# Altium project LV_breakout_1 - Copy.PrjPcb
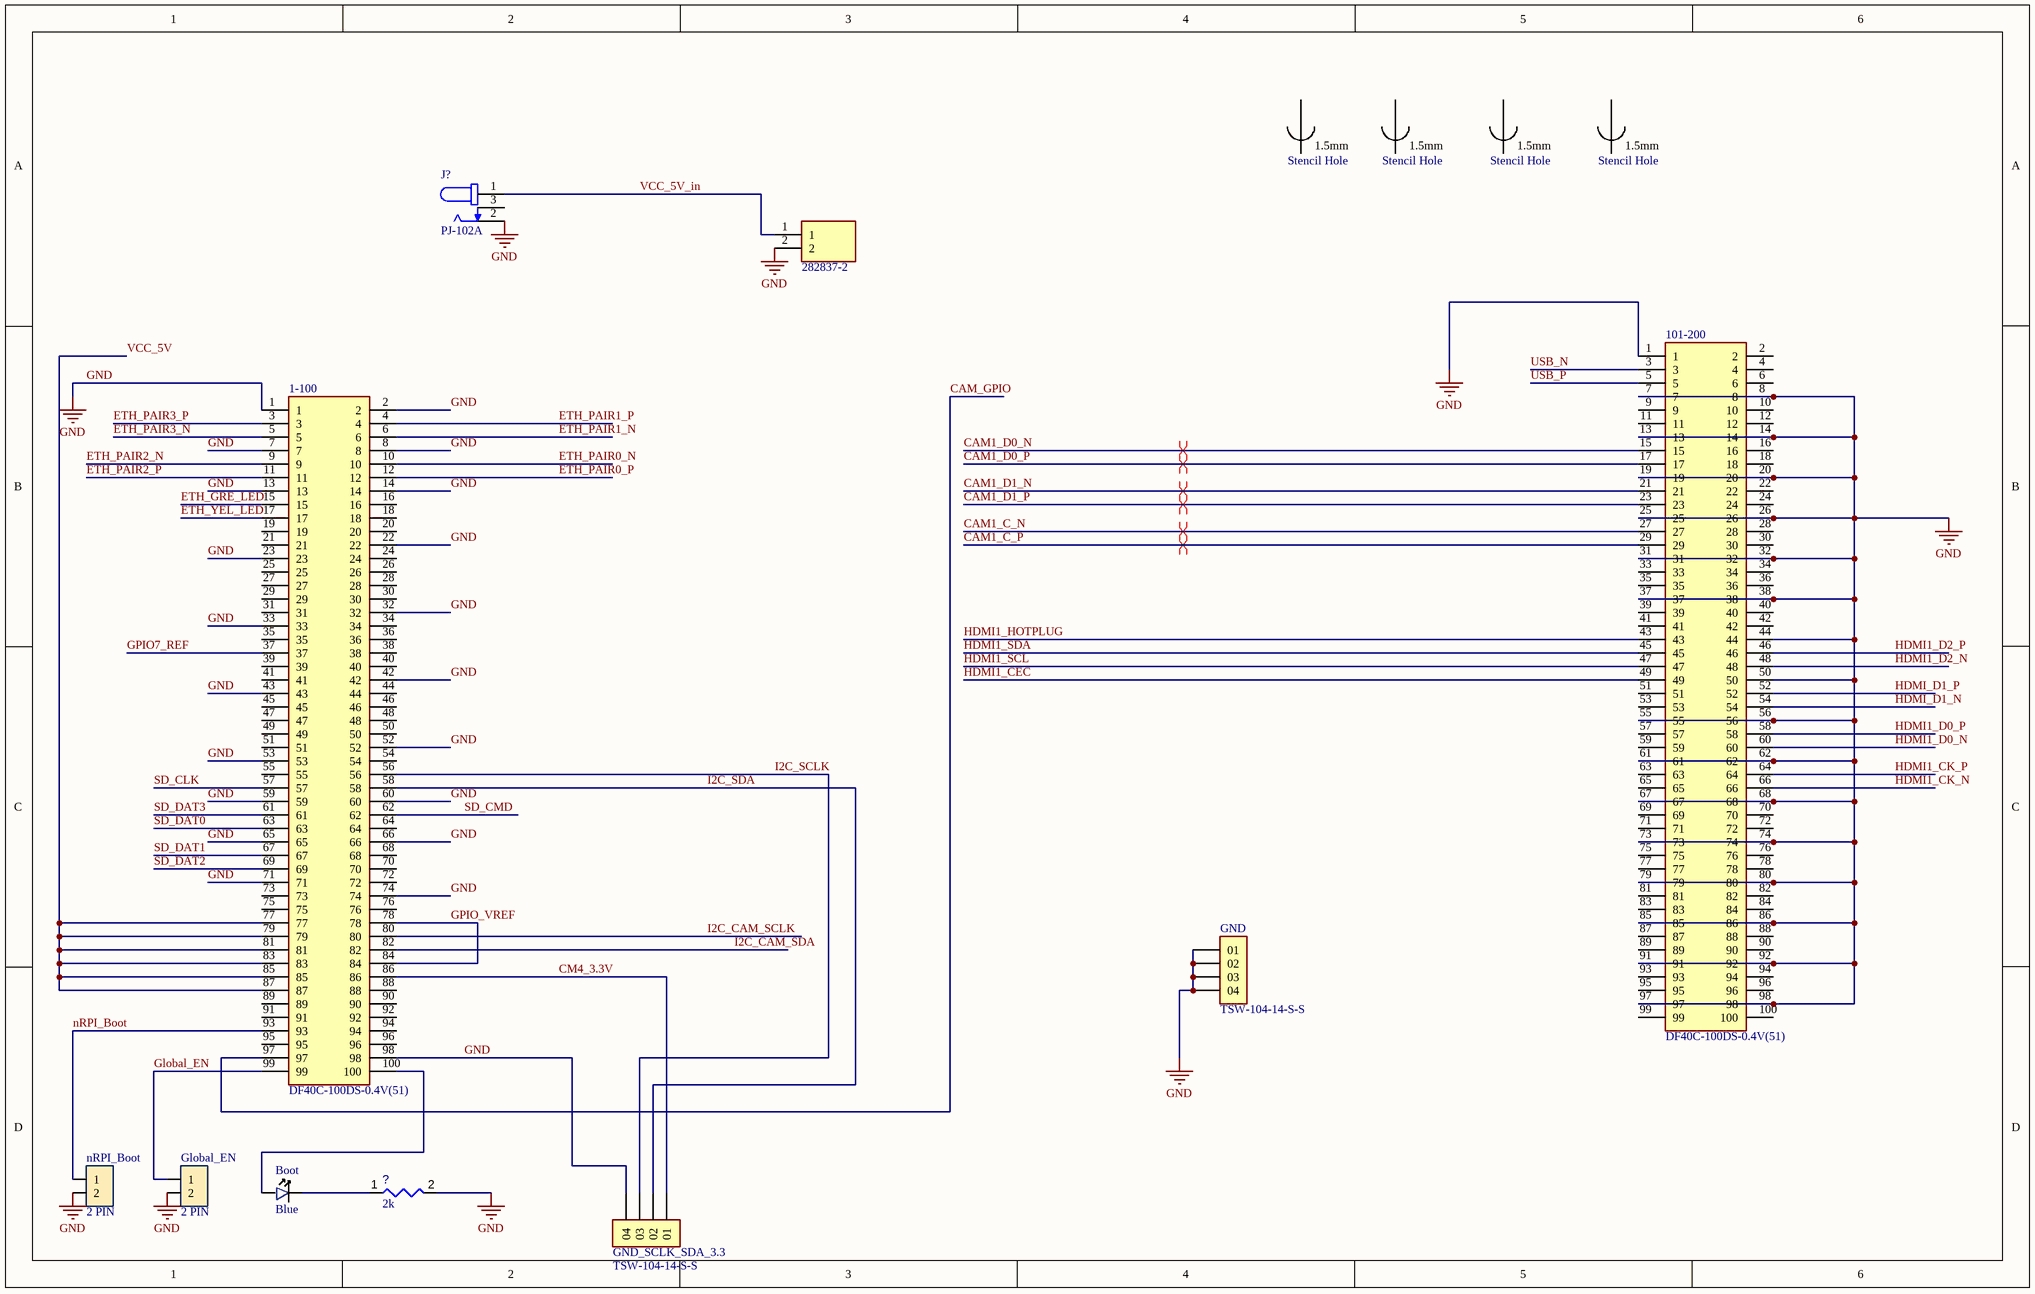
[diagram p0: LV_breakout_main.SchDoc]
5 sheets, 62 parts. Net scope: global (net labels, ports and power ports of the same name join across sheets).
Board file: LV_breakout_1.PcbDoc
Sheets:
  LV_breakout_main.SchDoc
  enviornment_IMU.SchDoc
  current_measure.SchDoc
  camera_hdmi.SchDoc
  USB_ETHERNET_SD.SchDoc

## Sheet LV_breakout_main.SchDoc
size 381 x 241 mm; SheetNumber: 1; SheetTotal: 5

### Parts
(Parts that share a designator on the sheet are numbered #1, #2 ... from top to bottom, then left to right.)
1-100  DF40C-100DS-0.4V(51)  [HRS_DF40C-100DS-0.4V(51)]
101-200  DF40C-100DS-0.4V(51)  [HRS_DF40C-100DS-0.4V(51)]
?#1  Stencil Hole  [AlignmentHole_1.5mm]
?#2  Stencil Hole  [AlignmentHole_1.5mm]
?#3  Stencil Hole  [AlignmentHole_1.5mm]
?#4  Stencil Hole  [AlignmentHole_1.5mm]
?#5  282837-2  [2828372]
?#6  value 2k  [RESC2013X50X35ML15T15]  (hidden comment: Resistor 10k +/-1% 0805 125 mW)
Boot  value Blue  [LED_0603]  (hidden comment: 0603Bl)
Global_EN  2 PIN  [2_PIN_100MIL]
GND  TSW-104-14-S-S  [JM-4_TSW-104-14-S-S]
GND_SCLK_SDA_3.3  TSW-104-14-S-S  [JM-4_TSW-104-14-S-S]
J?  PJ-102A  [CUI_PJ-102A]
nRPI_Boot  2 PIN  [2_PIN_100MIL]

### Nets
GND: 1-100.1 1-100.2 1-100.7 1-100.8 1-100.13 1-100.14 1-100.22 1-100.23 1-100.32 1-100.33 1-100.42 1-100.43 1-100.52 1-100.53 1-100.59 1-100.60 1-100.65 1-100.66 1-100.71 1-100.74 1-100.98 101-200.1 101-200.7 101-200.8 101-200.13 101-200.14 101-200.19 101-200.20 101-200.25 101-200.26 101-200.31 101-200.32 101-200.37 101-200.38 101-200.44 101-200.50 101-200.55 101-200.56 101-200.61 101-200.62 101-200.67 101-200.68 101-200.73 101-200.74 101-200.79 101-200.80 101-200.85 101-200.86 101-200.91 101-200.92 101-200.97 101-200.98 ?#5.2 ?#6.2 Global_EN.2 GND.01 GND.02 GND.03 GND.04 GND_SCLK_SDA_3.3.04 J?.2 nRPI_Boot.2
CAM1_C_N: 101-200.27
CAM1_C_P: 101-200.29
CAM1_D0_N: 101-200.15
CAM1_D0_P: 101-200.17
CAM1_D1_N: 101-200.21
CAM1_D1_P: 101-200.23
CAM_GPIO: 1-100.97
CM4_3.3V: 1-100.86 GND_SCLK_SDA_3.3.01
ETH_GRE_LED: 1-100.15
ETH_PAIR0_N: 1-100.10
ETH_PAIR0_P: 1-100.12
ETH_PAIR1_N: 1-100.6
ETH_PAIR1_P: 1-100.4
ETH_PAIR2_N: 1-100.9
ETH_PAIR2_P: 1-100.11
ETH_PAIR3_N: 1-100.5
ETH_PAIR3_P: 1-100.3
ETH_YEL_LED: 1-100.17
Global_EN: 1-100.99 Global_EN.1
GPIO7_REF: 1-100.37
GPIO_VREF: 1-100.78 1-100.84
HDMI1_CEC: 101-200.49
HDMI1_CK_N: 101-200.66
HDMI1_CK_P: 101-200.64
HDMI1_D0_N: 101-200.60
HDMI1_D0_P: 101-200.58
HDMI1_D2_N: 101-200.48
HDMI1_D2_P: 101-200.46
HDMI1_HOTPLUG: 101-200.43
HDMI1_SCL: 101-200.47
HDMI1_SDA: 101-200.45
HDMI_D1_N: 101-200.54
HDMI_D1_P: 101-200.52
I2C_CAM_SCLK: 1-100.80
I2C_CAM_SDA: 1-100.82
I2C_SCLK: 1-100.56 GND_SCLK_SDA_3.3.03
I2C_SDA: 1-100.58 GND_SCLK_SDA_3.3.02
nRPI_Boot: 1-100.93 nRPI_Boot.1
SD_CLK: 1-100.57
SD_CMD: 1-100.62
SD_DAT0: 1-100.63
SD_DAT1: 1-100.67
SD_DAT2: 1-100.69
SD_DAT3: 1-100.61
USB_N: 101-200.3
USB_P: 101-200.5
VCC_5V: 1-100.77 1-100.79 1-100.81 1-100.83 1-100.85 1-100.87
VCC_5V_in: ?#5.1 J?.1
Net1-100_100: 1-100.100 Boot.1
Net?#6_1: ?#6.1 Boot.2

Not connected (* = marked no-connect by the designer): 1-100 16 18 19 20 21 24 25 26 27 28 29 30 31 34 35 36 38 39 40 41 44 45 46 47 48 49 50 51 54 55 64 68 70 72 73 75 76 88 89 90 91 92 94 95 96; 101-200 2 4 6 9 10 11 12 16 18 22 24 28 30 33 34 35 36 39 40 41 42 51 53 57 59 63 65 69 70 71 72 75 76 77 78 81 82 83 84 87 88 89 90 93 94 95 96 99 100; J? 3

### Layout directives
differential pair: CAM1_C_N, CAM1_C_P, CAM1_D0_N, CAM1_D0_P, CAM1_D1_N, CAM1_D1_P

### Notes on the sheet
- (in symbol H_StencilAllignment_1.5mm) 1.5mm

### Library data of the parts
1-100 101-200 = CMP-005-000000-1: DF40 Series 100 Position Dual Row 0.4 mm Pitch Surface Mount Vertical Receptacle; Price: None; Component Type: Standard; Design Item ID: DF40C-100DS-0.4V(51); Package: None; Source: DF40C-100DS-0.4V(51).SchLib; Availability: Unavailable; MP: DF40C-100DS-0.4V(51); Pin Count: 100; Value: *
?#1-?#4 = H_StencilAllignment_1.5mm: Stencil Allignment hole for use with 1.5mm pin
?#5 = 282837-2: Fixed Terminal Blocks 5.08MM PCB MOUNT 2P; Manufacturer_Name: TE Connectivity; Geometry.Height: 10.3mm; Manufacturer_Part_Number: 282837-2; Mouser Part Number: 571-2828372; Mouser Price/Stock: https://www.mouser.co.uk/ProductDetail/TE-Connectivity/282837-2?qs=A%252Bip%252BNCYi6O2H0NGWOeAxg%3D%3D; Arrow Part Number: 282837-2; Arrow Price/Stock: https://www.arrow.com/en/products/282837-2/te-connectivity?region=europe; Datasheet Link: https://www.te.com/commerce/DocumentDelivery/DDEController?Action=srchrtrv&DocNm=282837&DocType=Customer+Drawing&DocLang=English&DocFormat=pdf&PartCntxt=282837-2
?#6 = CMP-009-00018-5: Chip Resistor, 10 KOhm, +/- 1%, 125 mW, -55 to 155 degC, 0805 (2012 Metric); Power: 125mW; Voltage Rating: 150V; Tolerance: 1%; Pins: 2; Min Operating Temperature: -55°C; Case/Package: 0805; Max Operating Temperature: 155°C; RoHS Compliant: True; Mounting Technology: SM
Boot = LED_BLUE_0603: LIGHT EMITTING DIODES (LED) BLUE 465~475NM 11.5~28.5MCD@5MA TOP VIEW 0603 ROHS; MFR Part #: 19-217/BHC-ZL1M2RY/3T; LCSC Part#: C72041; Type: Basic
Global_EN nRPI_Boot = JM_2_PIN_MALE: 2.54mm Straight 2 1 Header，Breakaway Through Hole,P=2.54mm Pin Header & Female Header ROHS; MFR Part #: B-2100S02P-A110; Type: Extended; Datasheet: https://datasheet.lcsc.com/lcsc/1811151421_Ckmtw-Shenzhen-Cankemeng-B-2100S02P-A110_C124375.pdf; LCSC Part#: C124375; Value: 2 PIN
GND GND_SCLK_SDA_3.3 = JM_4_PIN_MALE: Square Pins 2.5mm 6mm -40℃~+105℃ 1 4 3mm 2.54mm Black 1x4P Straight,P=2.54mm  Pin Headers ROHS; MFR PART #: PZ254V-11-04P; MP: TSW-104-14-S-S; LCSC PART#: C2691448
J? = PJ-102A: 2.0 x 6.5 mm, 2.5 A, Horizontal, Through Hole, Tapered Pins, Dc Power Jack Connector; MF: CUI Devices; Price: None; Availability: In Stock; Package: None; MP: PJ-102A; CUI_purchase_URL: https://www.cuidevices.com/product/interconnect/connectors/dc-power-connectors/jacks/pj-102a?utm_source=snapeda.com&utm_medium=referral&utm_campaign=snapedaBOM; Value: *; SnapEDA_Link: https://www.snapeda.com/parts/PJ-102A/CUI+Devices/view-part/?ref=snap; Purchase-URL: https://pricing.snapeda.com/search/part/PJ-102A/?ref=eda; Check_prices: https://www.snapeda.com/parts/PJ-102A/CUI+Devices/view-part/?ref=eda

## Sheet enviornment_IMU.SchDoc
size A; SheetNumber: 2; SheetTotal: 5
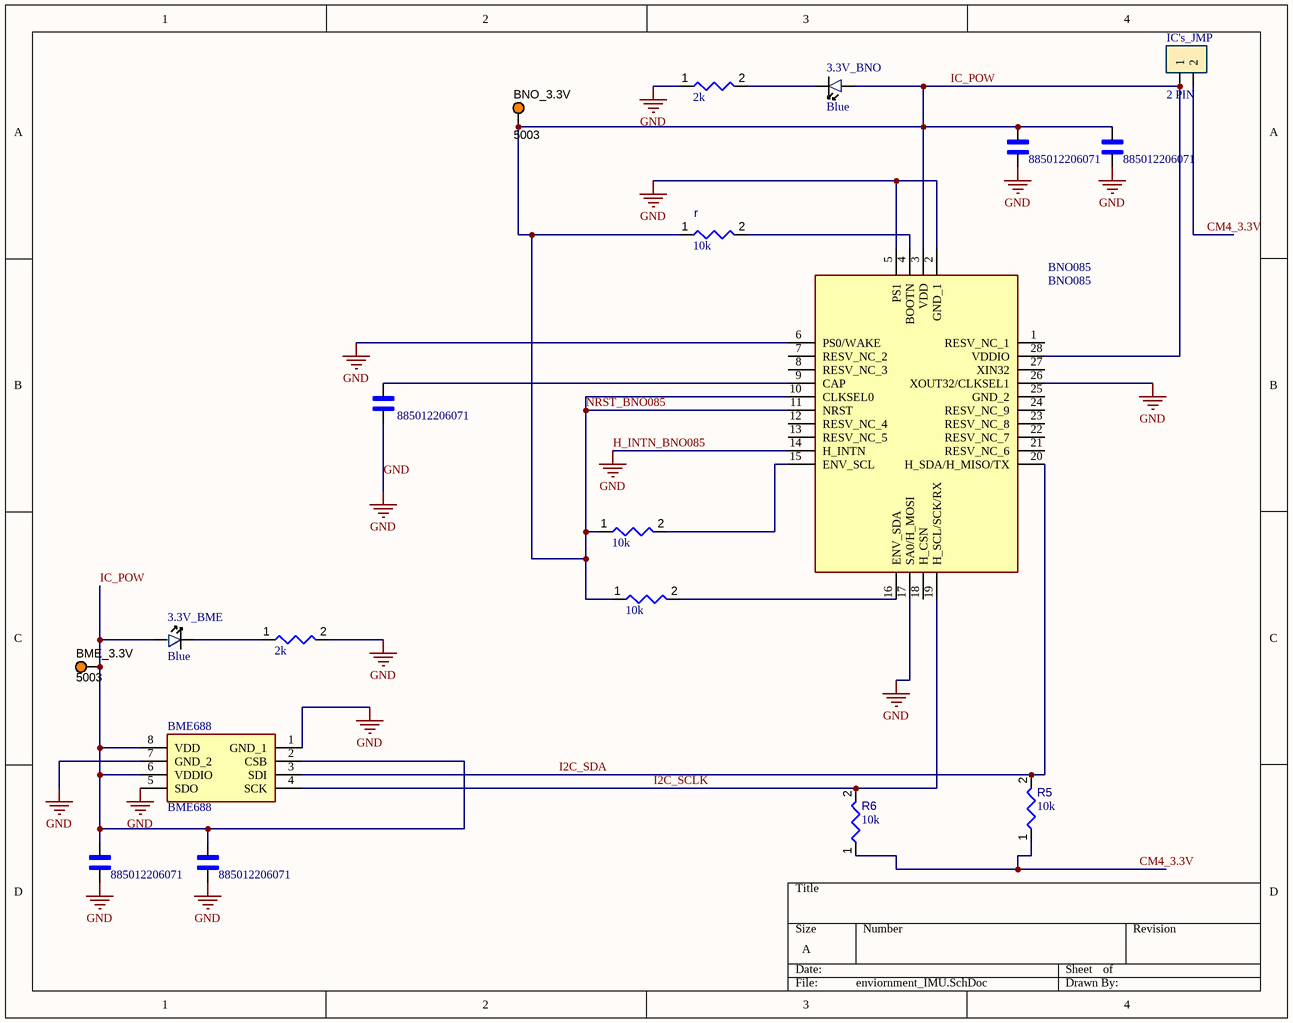
[diagram p1: enviornment_IMU.SchDoc]

### Parts
(Parts that share a designator on the sheet are numbered #1, #2 ... from top to bottom, then left to right.)
3.3V_BME  value Blue  [LED_0603]  (hidden comment: 0603Bl)
3.3V_BNO  value Blue  [LED_0603]  (hidden comment: 0603Bl)
?#7  value 2k  [RESC2013X50X35ML15T15]  (hidden comment: Resistor 10k +/-1% 0805 125 mW)
?#8  885012206071  [WCAP-CSGP_885012206071]
?#9  885012206071  [WCAP-CSGP_885012206071]
?#10  885012206071  [WCAP-CSGP_885012206071]
?#11  value 10k  [RESC2013X50X35ML15T15]  (hidden comment: Resistor 10k +/-1% 0805 125 mW)
?#12  value 10k  [RESC2013X50X35ML15T15]  (hidden comment: Resistor 10k +/-1% 0805 125 mW)
?#13  value 2k  [RESC2013X50X35ML15T15]  (hidden comment: Resistor 10k +/-1% 0805 125 mW)
?#14  885012206071  [WCAP-CSGP_885012206071]
?#15  885012206071  [WCAP-CSGP_885012206071]
BME688  BME688  [BME688]
BME_3.3V  5003  [KSTN-5003]
BNO085  BNO085  [BNO085]
BNO_3.3V  5003  [KSTN-5003]
IC's_JMP  2 PIN  [2_PIN_100MIL]
r  value 10k  [RESC2013X50X35ML15T15]  (hidden comment: Resistor 10k +/-1% 0805 125 mW)
R5  value 10k  [RESC2013X50X35ML15T15]  (hidden comment: Resistor 10k +/-1% 0805 125 mW)
R6  value 10k  [RESC2013X50X35ML15T15]  (hidden comment: Resistor 10k +/-1% 0805 125 mW)

### Nets
GND: ?#7.1 ?#8.2 ?#9.2 ?#10.2 ?#13.2 ?#14.2 ?#15.2 BME688.1(GND_1) BME688.5(SDO) BME688.7(GND_2) BNO085.2(GND_1) BNO085.5(PS1) BNO085.6(PS0/WAKE) BNO085.14(H_INTN) BNO085.17(SA0/H_MOSI) BNO085.26(XOUT32/CLKSEL1)  [also labelled H_INTN_BNO085]
CM4_3.3V: IC's_JMP.2 R5.1 R6.1
I2C_SCLK: BME688.4(SCK) BNO085.19(H_SCL/SCK/RX) R6.2
I2C_SDA: BME688.3(SDI) BNO085.20(H_SDA/H_MISO/TX) R5.2
IC_POW: 3.3V_BME.1 3.3V_BNO.1 ?#8.1 ?#9.1 ?#11.1 ?#12.1 ?#14.1 ?#15.1 BME688.2(CSB) BME688.6(VDDIO) BME688.8(VDD) BME_3.3V.1 BNO085.3(VDD) BNO085.10(CLKSEL0) BNO085.11(NRST) BNO085.28(VDDIO) BNO_3.3V.1 IC's_JMP.1 r.1  [also labelled NRST_BNO085]
Net3.3V_BME_2: 3.3V_BME.2 ?#13.1
Net3.3V_BNO_2: 3.3V_BNO.2 ?#7.2
Net?#10_1: ?#10.1 BNO085.9(CAP)
Net?#11_2: ?#11.2 BNO085.15(ENV_SCL)
Net?#12_2: ?#12.2 BNO085.16(ENV_SDA)
NetBNO085_4: BNO085.4(BOOTN) r.2

Not connected (* = marked no-connect by the designer): BNO085 1(RESV_NC_1) 7(RESV_NC_2) 8(RESV_NC_3) 12(RESV_NC_4) 13(RESV_NC_5) 18(H_CSN) 21(RESV_NC_6) 22(RESV_NC_7) 23(RESV_NC_8) 24(RESV_NC_9) 25(GND_2) 27(XIN32)

### Library data of the parts
3.3V_BME 3.3V_BNO = LED_BLUE_0603: as Boot on sheet LV_breakout_main; LCSC Part#: C72041; Type: Basic
?#7 ?#11-?#13 r R5 R6 = CMP-009-00018-5: as ?#6 on sheet LV_breakout_main; Tolerance: 1%; Pins: 2; Min Operating Temperature: -55°C; Case/Package: 0805; Max Operating Temperature: 155°C; RoHS Compliant: True; Mounting Technology: SM
?#8-?#10 ?#14 ?#15 = 885012206071: WCAP-CSGP General Purpose MLCC; SMT 0603; X7R; 100nF 10%; 25V; -55C to +125C; Tech. PN X7R0603104K025DFCT10000; MF: Wurth Electronics Inc; Package: 0603 Wurth Electronics; Purchase-URL: https://pricing.snapeda.com/search/part/885012206071/?ref=eda; Price: None; Value: *; Availability: Warning; MP: 885012206071; SnapEDA_Link: https://www.snapeda.com/parts/885012206071/Wurth%20Electronics%20Inc/view-part/4217095/?ref=snap
BME688 = BME688: Gas sensor measuring relative humidity, barometric pressure, ambient temperature and gas (VOC); Manufacturer_Name: BOSCH; Geometry.Height: 1mm; Manufacturer_Part_Number: BME688; Mouser Part Number: 262-BME688; Mouser Price/Stock: https://www.mouser.co.uk/ProductDetail/Bosch-Sensortec/BME688?qs=IS%252B4QmGtzzqQoVDscqwx3A%3D%3D; Arrow Part Number: BME688; Arrow Price/Stock: https://www.arrow.com/en/products/bme688/bosch?region=europe; Datasheet Link: https://www.bosch-sensortec.com/media/boschsensortec/downloads/datasheets/bst-bme688-ds000.pdf
BME_3.3V BNO_3.3V = CMP-002-00037-2: Test Point, Orange, Height 4.6 mm, Tail Length 3 mm, 1-Pin THD, RoHS; Manufacturer: Keystone; Colour: Orange; Packaging: Bulk; Package Description: 1-Pin Through Hole Device, Dia 2.54 mm; Pins: 1; Package Reference: 5003; Datasheet Version: Jun-15; Case/Package: 5003; Mounting Technology: TH; Connector Type: TestPoint; Diameter: 2.54mm; Contact Material: Bronze; Datasheet URL: http://keyelco.com/userAssets/file/M65p56.pdf; Manufacturer URL: http://www.keyelco.com/; Package Quantity: 10; Contact Plating: Tin; RoHS Compliant: True
BNO085 = BNO085: IMU ACCEL/GYRO/MAG I2C 32BIT; Manufacturer_Name: Hillcrest Laboratories, Inc.; Geometry.Height: 1.18mm; Manufacturer_Part_Number: BNO085; Mouser Part Number: *; Mouser Price/Stock: *; Arrow Part Number: *; Arrow Price/Stock: *; Datasheet Link: https://www.hillcrestlabs.com/downloads/bno080-datasheet
IC's_JMP = JM_2_PIN_MALE: as Global_EN on sheet LV_breakout_main; Type: Extended; Datasheet: https://datasheet.lcsc.com/lcsc/1811151421_Ckmtw-Shenzhen-Cankemeng-B-2100S02P-A110_C124375.pdf; LCSC Part#: C124375; Value: 2 PIN

## Sheet current_measure.SchDoc
size A; SheetNumber: 3; SheetTotal: 5
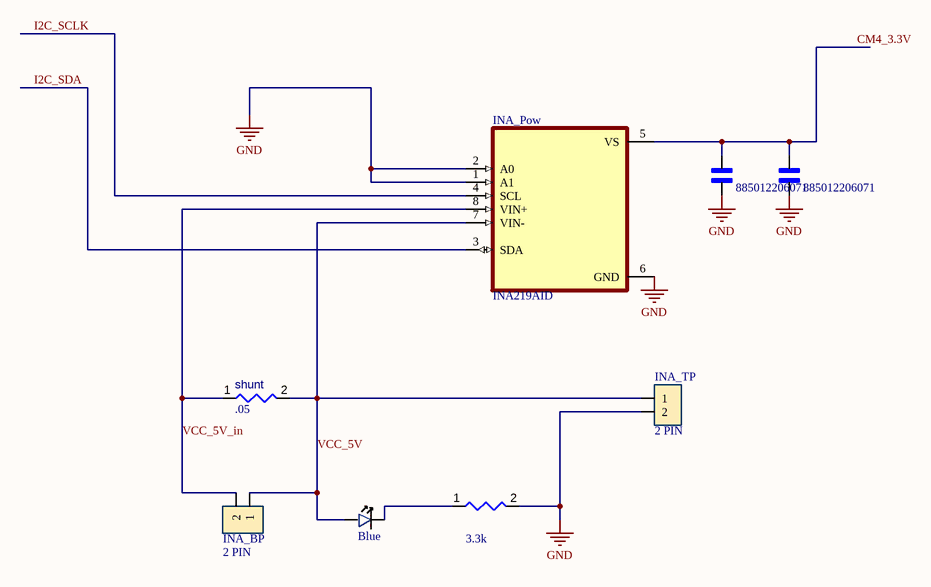
[diagram p2: current_measure.SchDoc]

### Parts
(Parts that share a designator on the sheet are numbered #1, #2 ... from top to bottom, then left to right.)
?#16  885012206071  [WCAP-CSGP_885012206071]
?#17  885012206071  [WCAP-CSGP_885012206071]
?#18  value 3.3k  [RESC2013X50X35ML15T15]  (hidden comment: Resistor 10k +/-1% 0805 125 mW)
?#19  value Blue  [LED_0603]  (hidden comment: 0603Bl)
INA_BP  2 PIN  [2_PIN_100MIL]
INA_Pow  INA219AID  [SOIC127P599X175-8N]
INA_TP  2 PIN  [2_PIN_100MIL]
shunt  value .05  [RESC2013X50X35ML15T15]  (hidden comment: Resistor 10k +/-1% 0805 125 mW)

### Nets
GND: ?#16.2 ?#17.2 ?#18.2 INA_Pow.1(A1) INA_Pow.2(A0) INA_Pow.6(GND) INA_TP.2
CM4_3.3V: ?#16.1 ?#17.1 INA_Pow.5(VS)
I2C_SCLK: INA_Pow.4(SCL)
I2C_SDA: INA_Pow.3(SDA)
VCC_5V: ?#19.1 INA_BP.1 INA_Pow.7(VIN-) INA_TP.1 shunt.2
VCC_5V_in: INA_BP.2 INA_Pow.8(VIN+) shunt.1
Net?#18_1: ?#18.1 ?#19.2

### Library data of the parts
?#16 ?#17 = 885012206071: as ?#8 on sheet enviornment_IMU; Package: 0603 Wurth Electronics; Purchase-URL: https://pricing.snapeda.com/search/part/885012206071/?ref=eda; Price: None; Value: *; Availability: Warning; MP: 885012206071; SnapEDA_Link: https://www.snapeda.com/parts/885012206071/Wurth%20Electronics%20Inc/view-part/4217095/?ref=snap
?#18 shunt = CMP-009-00018-5: as ?#6 on sheet LV_breakout_main; Tolerance: 1%; Pins: 2; Min Operating Temperature: -55°C; Case/Package: 0805; Max Operating Temperature: 155°C; RoHS Compliant: True; Mounting Technology: SM
?#19 = LED_BLUE_0603: as Boot on sheet LV_breakout_main; LCSC Part#: C72041; Type: Basic
INA_BP INA_TP = JM_2_PIN_MALE: as Global_EN on sheet LV_breakout_main; Type: Extended; Datasheet: https://datasheet.lcsc.com/lcsc/1811151421_Ckmtw-Shenzhen-Cankemeng-B-2100S02P-A110_C124375.pdf; LCSC Part#: C124375; Value: 2 PIN
INA_Pow = INA219AID: 26V, 12-bit, i2c output current/voltage/power monitor 8-SOIC -40 to 125; MF: Texas Instruments; Purchase-URL: https://pricing.snapeda.com/search/part/INA219AID/?ref=eda; Package: SOIC-8 Texas Instruments; SnapEDA_Link: https://www.snapeda.com/parts/INA219AID/Texas%20Instruments/view-part/522322/?ref=snap; Value: *; Price: None; MP: INA219AID; Availability: Warning; Check_prices: https://www.snapeda.com/parts/INA219AID/Texas%20Instruments/view-part/522322/?ref=eda

## Sheet camera_hdmi.SchDoc
size 431 x 279 mm; SheetNumber: 4; SheetTotal: 5
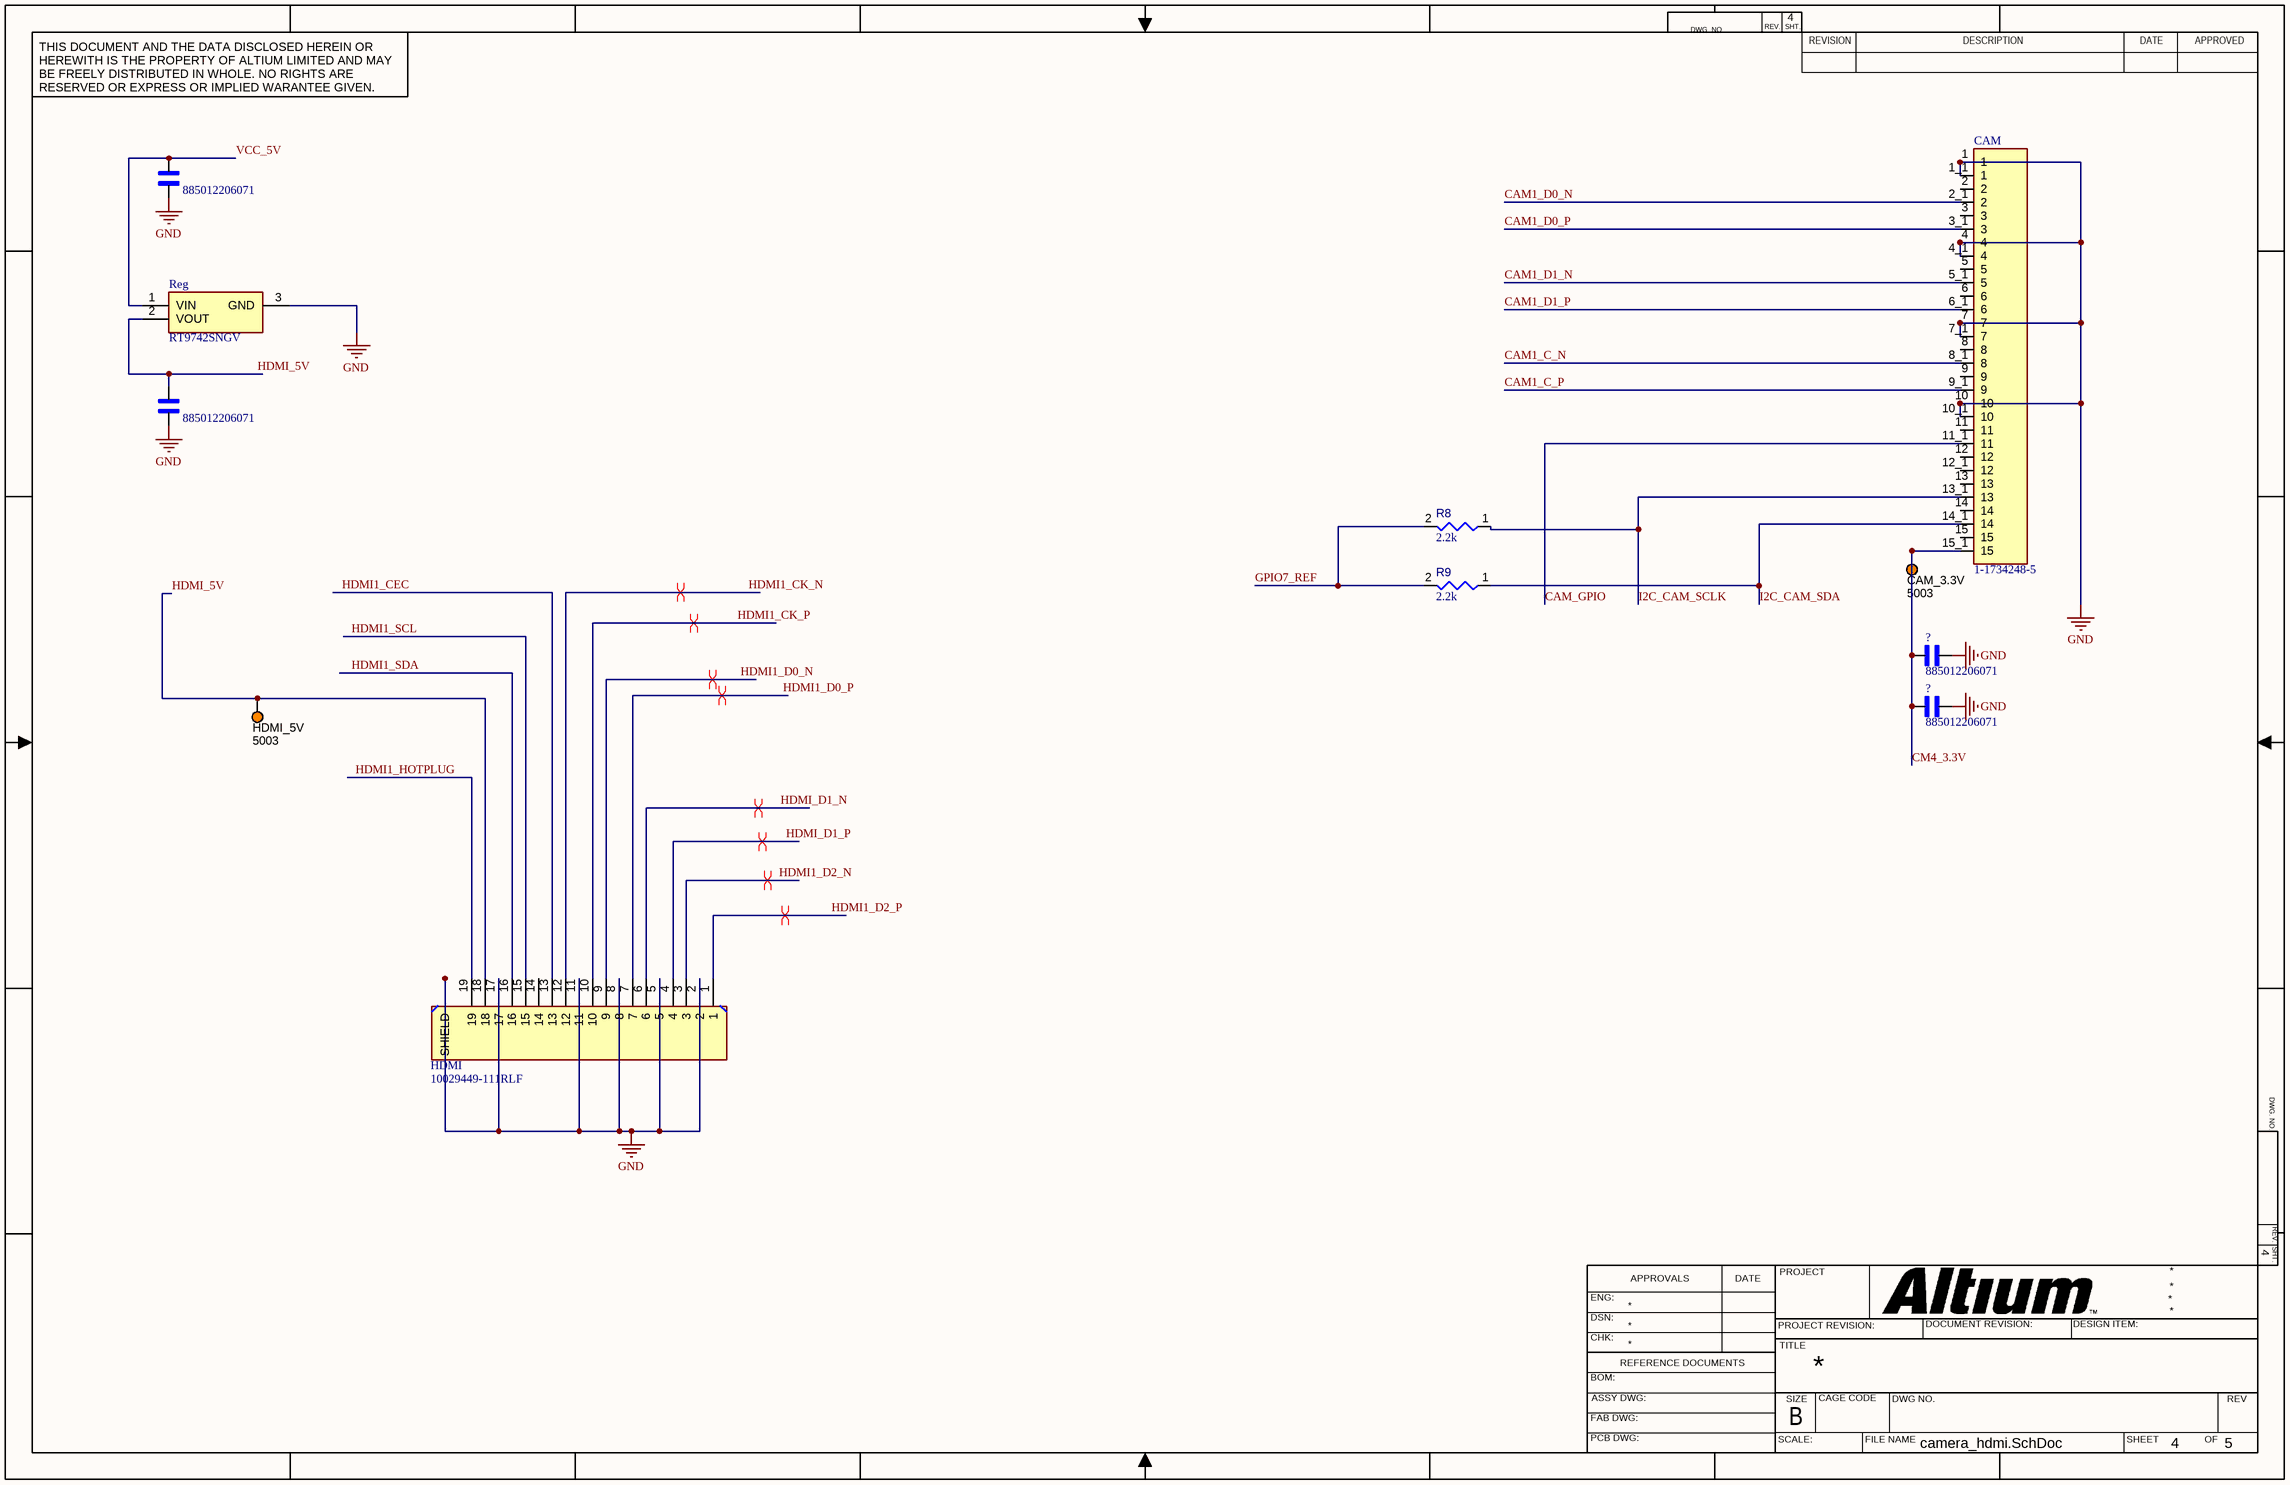
[diagram p3: camera_hdmi.SchDoc]

### Parts
(Parts that share a designator on the sheet are numbered #1, #2 ... from top to bottom, then left to right.)
?#20  885012206071  [WCAP-CSGP_885012206071]
?#21  885012206071  [WCAP-CSGP_885012206071]
?#22  885012206071  [WCAP-CSGP_885012206071]
?#23  885012206071  [WCAP-CSGP_885012206071]
CAM  1-1734248-5  [TE_1-1734248-5]
CAM_3.3V  5003  [KSTN-5003]
HDMI  10029449-111RLF  [AMPHENOL_10029449-111RLF]
HDMI_5V  5003  [KSTN-5003]
R8  value 2.2k  [RESC2013X50X35ML15T15]  (hidden comment: Resistor 10k +/-1% 0805 125 mW)
R9  value 2.2k  [RESC2013X50X35ML15T15]  (hidden comment: Resistor 10k +/-1% 0805 125 mW)
Reg  RT9742SNGV  [SOT95P279X130-3N]

### Nets
GND: ?#20.2 ?#21.2 ?#22.2 ?#23.2 CAM.1 CAM.1_1(1) CAM.4 CAM.4_1(4) CAM.7 CAM.7_1(7) CAM.10 CAM.10_1(10) HDMI.2 HDMI.5 HDMI.8 HDMI.11 HDMI.17 HDMI.S1(SHIELD) HDMI.S2(SHIELD) HDMI.S3(SHIELD) HDMI.S4(SHIELD) Reg.3(GND)
CAM1_C_N: CAM.8_1(8)
CAM1_C_P: CAM.9_1(9)
CAM1_D0_N: CAM.2_1(2)
CAM1_D0_P: CAM.3_1(3)
CAM1_D1_N: CAM.5_1(5)
CAM1_D1_P: CAM.6_1(6)
CAM_GPIO: CAM.11_1(11)
CM4_3.3V: ?#22.1 ?#23.1 CAM.15_1(15) CAM_3.3V.1
GPIO7_REF: R8.2 R9.2
HDMI1_CEC: HDMI.13
HDMI1_CK_N: HDMI.12
HDMI1_CK_P: HDMI.10
HDMI1_D0_N: HDMI.9
HDMI1_D0_P: HDMI.7
HDMI1_D2_N: HDMI.3
HDMI1_D2_P: HDMI.1
HDMI1_HOTPLUG: HDMI.19
HDMI1_SCL: HDMI.15
HDMI1_SDA: HDMI.16
HDMI_5V: ?#21.1 HDMI.18 HDMI_5V.1 Reg.2(VOUT)
HDMI_D1_N: HDMI.6
HDMI_D1_P: HDMI.4
I2C_CAM_SCLK: CAM.13_1(13) R8.1
I2C_CAM_SDA: CAM.14_1(14) R9.1
VCC_5V: ?#20.1 Reg.1(VIN)

Not connected (* = marked no-connect by the designer): CAM 2 3 5 6 8 9 11 12 12_1(12) 13 14 15; HDMI 14

### Layout directives
differential pair: HDMI1_CK_N, HDMI1_CK_P, HDMI1_D0_N, HDMI1_D0_P, HDMI1_D2_N, HDMI1_D2_P, HDMI_D1_N, HDMI_D1_P

### Notes on the sheet
- DWG. NO.
- REV.
- SHT.
- THIS DOCUMENT AND THE DATA DISCLOSED HEREIN OR HEREWITH IS THE PROPERTY OF ALTIUM LIMITED AND MAY BE FREELY DISTRIBUTED IN WHOLE. NO RIGHTS ARE RESERVED OR EXPRESS OR IMPLIED WARANTEE GIVEN.
- REVISION
- DESCRIPTION
- DATE
- APPROVED
- ENG:
- APPROVALS
- PROJECT
- DSN:
- CHK:
- REFERENCE DOCUMENTS
- PROJECT REVISION:
- TITLE
- DOCUMENT REVISION:
- DESIGN ITEM:
- BOM:
- FAB DWG:
- PCB DWG:
- ASSY DWG:
- SCALE:
- SIZE
- B
- CAGE CODE
- FILE NAME
- DWG NO.
- SHEET
- OF
- REV

### Library data of the parts
?#20-?#23 = 885012206071: as ?#8 on sheet enviornment_IMU; Package: 0603 Wurth Electronics; Purchase-URL: https://pricing.snapeda.com/search/part/885012206071/?ref=eda; Price: None; Value: *; Availability: Warning; MP: 885012206071; SnapEDA_Link: https://www.snapeda.com/parts/885012206071/Wurth%20Electronics%20Inc/view-part/4217095/?ref=snap
CAM = 1-1734248-5: FPC CONNECTOR, RECEPTACLE 15POS 1MMPITCH; Series:FPC; Gender:Receptacle; Pitch S; MF: TE Connectivity; EU_RoHS_Compliance: Compliant; MP: 1-1734248-5; TE_purchase_URL: https://www.te.com/usa-en/product-1-1734248-5.html?te_bu=Cor&te_type=disp&te_campaign=seda_glo_cor-seda-global-disp-prtnr-fy19-seda-model-bom-cta_sma-317_1&elqCampaignId=32493; SnapEDA_Link: https://www.snapeda.com/parts/1-1734248-5/TE%20Connectivity%20AMP%20Connectors/view-part/822357/?ref=snap; Package: None; Digi-Key_Purchase_URL: https://www.digikey.com/product-detail/en/te-connectivity-amp-connectors/1-1734248-5/A101418CT-ND/2567554?utm_source=snapeda&utm_medium=aggregator&utm_campaign=symbol; Digi-Key_Part_Number: A101418CT-ND; Value: *
CAM_3.3V HDMI_5V = CMP-002-00037-2: as BME_3.3V on sheet enviornment_IMU; Colour: Orange; Packaging: Bulk; Package Description: 1-Pin Through Hole Device, Dia 2.54 mm; Pins: 1; Package Reference: 5003; Datasheet Version: Jun-15; Case/Package: 5003; Mounting Technology: TH; Connector Type: TestPoint; Diameter: 2.54mm; Contact Material: Bronze; Datasheet URL: http://keyelco.com/userAssets/file/M65p56.pdf; Manufacturer URL: http://www.keyelco.com/; Package Quantity: 10; Contact Plating: Tin; RoHS Compliant: True
HDMI = 10029449-111RLF: HDMI, Input Output Connectors, Receptacle, Type A, Right Angle, Surface Mount, 19 Positions.; MF: AMPHENOL ICC / FCI; SnapEDA_Link: https://www.snapeda.com/parts/10029449-111RLF/Amphenol/view-part/?ref=snap; Package: None; Value: *; MP: 10029449-111RLF; Check_prices: https://www.snapeda.com/parts/10029449-111RLF/Amphenol/view-part/?ref=eda
R8 R9 = CMP-009-00018-5: as ?#6 on sheet LV_breakout_main; Tolerance: 1%; Pins: 2; Min Operating Temperature: -55°C; Case/Package: 0805; Max Operating Temperature: 155°C; RoHS Compliant: True; Mounting Technology: SM
Reg = RT9742SNGV: IC PWR SWITCH N-CHAN 1:1 SOT23-3; Manufacturer_Name: RICHTEK; Geometry.Height: 1.295mm; Manufacturer_Part_Number: RT9742SNGV; Mouser Part Number: *; Mouser Price/Stock: *; Arrow Part Number: *; Arrow Price/Stock: *; Datasheet Link: https://datasheet.lcsc.com/szlcsc/Richtek-Tech-RT9742ANGJ5F_C147955.pdf

## Sheet USB_ETHERNET_SD.SchDoc
size A; SheetNumber: 5; SheetTotal: 5
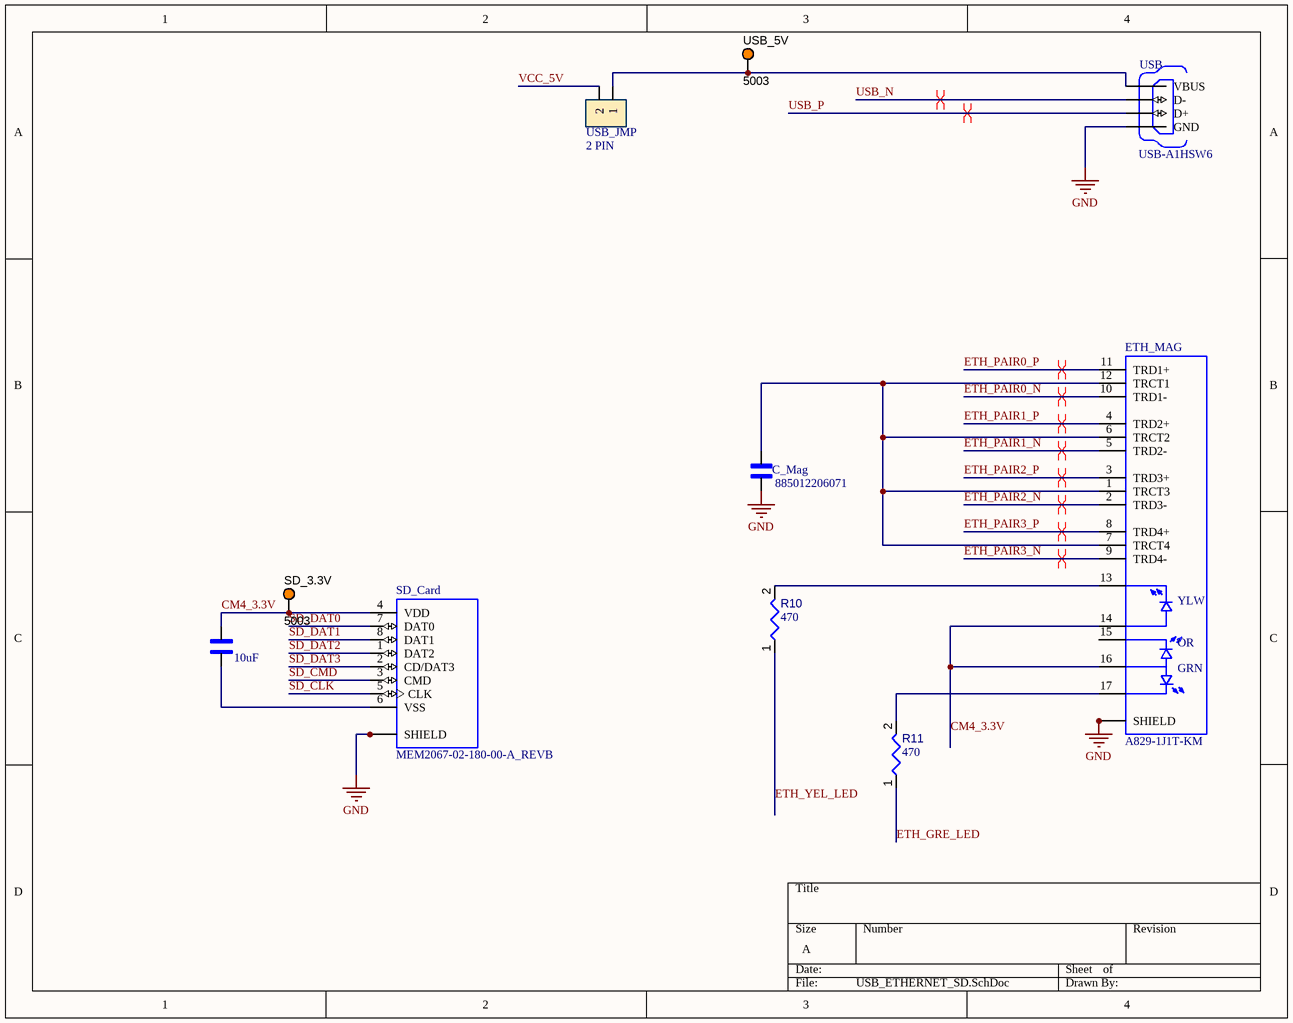
[diagram p4: USB_ETHERNET_SD.SchDoc]

### Parts
(Parts that share a designator on the sheet are numbered #1, #2 ... from top to bottom, then left to right.)
?#24  10uF  [0402_Passive_Capacitor]
C_Mag  885012206071  [WCAP-CSGP_885012206071]
ETH_MAG  A829-1J1T-KM  [BEL_A829-1J1T-KM]
R10  value 470  [RESC2013X50X35ML15T15]  (hidden comment: Resistor 10k +/-1% 0805 125 mW)
R11  value 470  [RESC2013X50X35ML15T15]  (hidden comment: Resistor 10k +/-1% 0805 125 mW)
SD_3.3V  5003  [KSTN-5003]
SD_Card  MEM2067-02-180-00-A_REVB  [GCT_MEM2067-02-180-00-A_REVB]
USB  USB-A1HSW6  [OST_USB-A1HSW6]
USB_5V  5003  [KSTN-5003]
USB_JMP  2 PIN  [2_PIN_100MIL]

### Nets
GND: C_Mag.2 ETH_MAG.S1(SHIELD) ETH_MAG.S2(SHIELD) SD_Card.9(SHIELD) SD_Card.10(SHIELD) SD_Card.11(SHIELD) SD_Card.12(SHIELD) USB.4(GND)
CM4_3.3V: ?#24.2 ETH_MAG.14 ETH_MAG.16 SD_3.3V.1 SD_Card.4(VDD)
ETH_GRE_LED: R11.1
ETH_PAIR0_N: ETH_MAG.10(TRD1-)
ETH_PAIR0_P: ETH_MAG.11(TRD1+)
ETH_PAIR1_N: ETH_MAG.5(TRD2-)
ETH_PAIR1_P: ETH_MAG.4(TRD2+)
ETH_PAIR2_N: ETH_MAG.2(TRD3-)
ETH_PAIR2_P: ETH_MAG.3(TRD3+)
ETH_PAIR3_N: ETH_MAG.9(TRD4-)
ETH_PAIR3_P: ETH_MAG.8(TRD4+)
ETH_YEL_LED: R10.1
SD_CLK: SD_Card.5(CLK)
SD_CMD: SD_Card.3(CMD)
SD_DAT0: SD_Card.7(DAT0)
SD_DAT1: SD_Card.8(DAT1)
SD_DAT2: SD_Card.1(DAT2)
SD_DAT3: SD_Card.2(CD/DAT3)
USB_N: USB.2(D-)
USB_P: USB.3(D+)
VCC_5V: USB_JMP.2
Net?#24_1: ?#24.1 SD_Card.6(VSS)
NetC_Mag_1: C_Mag.1 ETH_MAG.1(TRCT3) ETH_MAG.6(TRCT2) ETH_MAG.7(TRCT4) ETH_MAG.12(TRCT1)
NetETH_MAG_13: ETH_MAG.13 R10.2
NetETH_MAG_17: ETH_MAG.17 R11.2
NetUSB_1: USB.1(VBUS) USB_5V.1 USB_JMP.1

Not connected (* = marked no-connect by the designer): ETH_MAG 15

### Layout directives
differential pair: ETH_PAIR0_N, ETH_PAIR0_P, ETH_PAIR1_N, ETH_PAIR1_P, ETH_PAIR2_N, ETH_PAIR2_P, ETH_PAIR3_N, ETH_PAIR3_P, USB_N, USB_P

### Notes on the sheet
- (in symbol A829-1J1T-KM) YLW; OR; GRN

### Library data of the parts
?#24 = C_10uF_0402: 10uF ±20% 6.3V X5R 0402 Multilayer Ceramic Capacitors MLCC - SMD/SMT RoHS; MFR Part #: CL05A106MQ5NUNC; LCSC Part#: C15525; Datasheet: https://datasheet.lcsc.com/lcsc/1810191215_Samsung-Electro-Mechanics-CL05A106MQ5NUNC_C15525.pdf; Type: Basic; Value: 10uF
C_Mag = 885012206071: as ?#8 on sheet enviornment_IMU; Package: 0603 Wurth Electronics; Purchase-URL: https://pricing.snapeda.com/search/part/885012206071/?ref=eda; Price: None; Value: *; Availability: Warning; MP: 885012206071; SnapEDA_Link: https://www.snapeda.com/parts/885012206071/Wurth%20Electronics%20Inc/view-part/4217095/?ref=snap
ETH_MAG = A829-1J1T-KM: 1X1 | GIGABIT | Tab Up| Automotive Temperature | Low Profile | With LED; MF: Bel Magnetic Solutions; SnapEDA_Link: https://www.snapeda.com/parts/A829-1J1T-KM/Bel%20Magnetic%20Solutions/view-part/3611988/?ref=snap; Value: *; MP: A829-1J1T-KM; Availability: Warning; Package: None; Price: None; Mouser-Purchase-URL: https://snapeda.com/shop?store=Mouser&id=3611988
R10 R11 = CMP-009-00018-5: as ?#6 on sheet LV_breakout_main; Tolerance: 1%; Pins: 2; Min Operating Temperature: -55°C; Case/Package: 0805; Max Operating Temperature: 155°C; RoHS Compliant: True; Mounting Technology: SM
SD_3.3V USB_5V = CMP-002-00037-2: as BME_3.3V on sheet enviornment_IMU; Colour: Orange; Packaging: Bulk; Package Description: 1-Pin Through Hole Device, Dia 2.54 mm; Pins: 1; Package Reference: 5003; Datasheet Version: Jun-15; Case/Package: 5003; Mounting Technology: TH; Connector Type: TestPoint; Diameter: 2.54mm; Contact Material: Bronze; Datasheet URL: http://keyelco.com/userAssets/file/M65p56.pdf; Manufacturer URL: http://www.keyelco.com/; Package Quantity: 10; Contact Plating: Tin; RoHS Compliant: True
SD_Card = MEM2067-02-180-00-A_REVB: Micro SD Memory Card ConnectorSMT, Hinged, 1.80mm Profile; Price: None; Value: *; MP: MEM2067-02-180-00-A_REVB; Package: None; Availability: Unavailable
USB = USB-A1HSW6: USB-A (USB TYPE-A) - Receptacle Connector 4 Position Through Hole, Right Angle; MF: On Shore; Value: *; SnapEDA_Link: https://www.snapeda.com/parts/USB-A1HSW6/On+Shore+Technology+Inc./view-part/?ref=snap; Purchase-URL: https://pricing.snapeda.com/search/part/USB-A1HSW6/?ref=eda; Availability: In Stock; Price: None; Package: None; Check_prices: https://www.snapeda.com/parts/USB-A1HSW6/On+Shore+Technology+Inc./view-part/?ref=eda; MP: USB-A1HSW6
USB_JMP = JM_2_PIN_MALE: as Global_EN on sheet LV_breakout_main; Type: Extended; Datasheet: https://datasheet.lcsc.com/lcsc/1811151421_Ckmtw-Shenzhen-Cankemeng-B-2100S02P-A110_C124375.pdf; LCSC Part#: C124375; Value: 2 PIN

## Nets that join several sheets
GND: LV_breakout_main (62 pins), enviornment_IMU (16 pins), current_measure (7 pins), camera_hdmi (22 pins), USB_ETHERNET_SD (8 pins)
CAM1_C_N: LV_breakout_main (101-200.27), camera_hdmi (CAM.8_1)
CAM1_C_P: LV_breakout_main (101-200.29), camera_hdmi (CAM.9_1)
CAM1_D0_N: LV_breakout_main (101-200.15), camera_hdmi (CAM.2_1)
CAM1_D0_P: LV_breakout_main (101-200.17), camera_hdmi (CAM.3_1)
CAM1_D1_N: LV_breakout_main (101-200.21), camera_hdmi (CAM.5_1)
CAM1_D1_P: LV_breakout_main (101-200.23), camera_hdmi (CAM.6_1)
CAM_GPIO: LV_breakout_main (1-100.97), camera_hdmi (CAM.11_1)
CM4_3.3V: LV_breakout_main (1-100.86 GND_SCLK_SDA_3.3.01), enviornment_IMU (IC's_JMP.2 R5.1 R6.1), current_measure (?#16.1 ?#17.1 INA_Pow.5), camera_hdmi (?#22.1 ?#23.1 CAM.15_1 CAM_3.3V.1), USB_ETHERNET_SD (5 pins)
ETH_GRE_LED: LV_breakout_main (1-100.15), USB_ETHERNET_SD (R11.1)
ETH_PAIR0_N: LV_breakout_main (1-100.10), USB_ETHERNET_SD (ETH_MAG.10)
ETH_PAIR0_P: LV_breakout_main (1-100.12), USB_ETHERNET_SD (ETH_MAG.11)
ETH_PAIR1_N: LV_breakout_main (1-100.6), USB_ETHERNET_SD (ETH_MAG.5)
ETH_PAIR1_P: LV_breakout_main (1-100.4), USB_ETHERNET_SD (ETH_MAG.4)
ETH_PAIR2_N: LV_breakout_main (1-100.9), USB_ETHERNET_SD (ETH_MAG.2)
ETH_PAIR2_P: LV_breakout_main (1-100.11), USB_ETHERNET_SD (ETH_MAG.3)
ETH_PAIR3_N: LV_breakout_main (1-100.5), USB_ETHERNET_SD (ETH_MAG.9)
ETH_PAIR3_P: LV_breakout_main (1-100.3), USB_ETHERNET_SD (ETH_MAG.8)
ETH_YEL_LED: LV_breakout_main (1-100.17), USB_ETHERNET_SD (R10.1)
GPIO7_REF: LV_breakout_main (1-100.37), camera_hdmi (R8.2 R9.2)
HDMI1_CEC: LV_breakout_main (101-200.49), camera_hdmi (HDMI.13)
HDMI1_CK_N: LV_breakout_main (101-200.66), camera_hdmi (HDMI.12)
HDMI1_CK_P: LV_breakout_main (101-200.64), camera_hdmi (HDMI.10)
HDMI1_D0_N: LV_breakout_main (101-200.60), camera_hdmi (HDMI.9)
HDMI1_D0_P: LV_breakout_main (101-200.58), camera_hdmi (HDMI.7)
HDMI1_D2_N: LV_breakout_main (101-200.48), camera_hdmi (HDMI.3)
HDMI1_D2_P: LV_breakout_main (101-200.46), camera_hdmi (HDMI.1)
HDMI1_HOTPLUG: LV_breakout_main (101-200.43), camera_hdmi (HDMI.19)
HDMI1_SCL: LV_breakout_main (101-200.47), camera_hdmi (HDMI.15)
HDMI1_SDA: LV_breakout_main (101-200.45), camera_hdmi (HDMI.16)
HDMI_D1_N: LV_breakout_main (101-200.54), camera_hdmi (HDMI.6)
HDMI_D1_P: LV_breakout_main (101-200.52), camera_hdmi (HDMI.4)
I2C_CAM_SCLK: LV_breakout_main (1-100.80), camera_hdmi (CAM.13_1 R8.1)
I2C_CAM_SDA: LV_breakout_main (1-100.82), camera_hdmi (CAM.14_1 R9.1)
I2C_SCLK: LV_breakout_main (1-100.56 GND_SCLK_SDA_3.3.03), enviornment_IMU (BME688.4 BNO085.19 R6.2), current_measure (INA_Pow.4)
I2C_SDA: LV_breakout_main (1-100.58 GND_SCLK_SDA_3.3.02), enviornment_IMU (BME688.3 BNO085.20 R5.2), current_measure (INA_Pow.3)
SD_CLK: LV_breakout_main (1-100.57), USB_ETHERNET_SD (SD_Card.5)
SD_CMD: LV_breakout_main (1-100.62), USB_ETHERNET_SD (SD_Card.3)
SD_DAT0: LV_breakout_main (1-100.63), USB_ETHERNET_SD (SD_Card.7)
SD_DAT1: LV_breakout_main (1-100.67), USB_ETHERNET_SD (SD_Card.8)
SD_DAT2: LV_breakout_main (1-100.69), USB_ETHERNET_SD (SD_Card.1)
SD_DAT3: LV_breakout_main (1-100.61), USB_ETHERNET_SD (SD_Card.2)
USB_N: LV_breakout_main (101-200.3), USB_ETHERNET_SD (USB.2)
USB_P: LV_breakout_main (101-200.5), USB_ETHERNET_SD (USB.3)
VCC_5V: LV_breakout_main (6 pins), current_measure (5 pins), camera_hdmi (?#20.1 Reg.1), USB_ETHERNET_SD (USB_JMP.2)
VCC_5V_in: LV_breakout_main (?#5.1 J?.1), current_measure (INA_BP.2 INA_Pow.8 shunt.1)